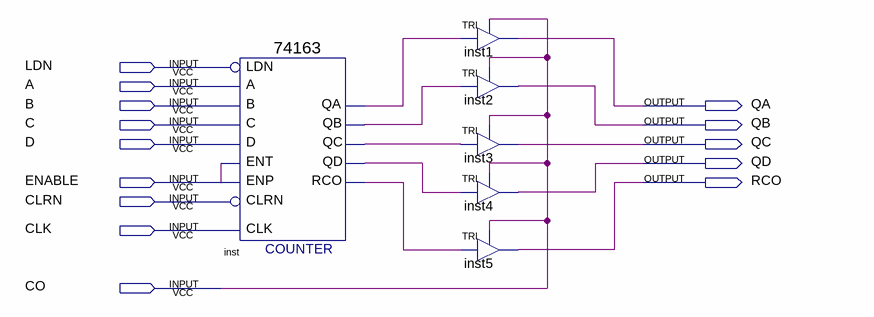
[diagram p0: schematic sheet]
// Quartus schematic counter4b.bdf as structural Verilog: 6 symbols, 14 pins
module counter4b (
  input  LDN,
  input  A,
  input  B,
  input  C,
  input  D,
  input  ENABLE,
  input  CLRN,
  input  CLK,
  input  CO,
  output QA,
  output QB,
  output QC,
  output QD,
  output RCO
);

  wire inst_qa, inst_qb, inst_qc, inst_qd, inst_rco;

  \74163  inst (
    .C(C), .B(B), .A(A), .ENT(ENABLE), .D(D), .CLRN(CLRN), .CLK(CLK), .ENP(ENABLE), .LDN(LDN), .QA(inst_qa),
    .QB(inst_qb), .QC(inst_qc), .QD(inst_qd), .RCO(inst_rco));
  TRI inst1 (.IN(inst_qa), .OE(CO), .OUT(QA));
  TRI inst2 (.IN(inst_qb), .OE(CO), .OUT(QB));
  TRI inst3 (.IN(inst_qc), .OE(CO), .OUT(QC));
  TRI inst4 (.IN(inst_qd), .OE(CO), .OUT(QD));
  TRI inst5 (.IN(inst_rco), .OE(CO), .OUT(RCO));
endmodule
